# Altium schematic sheet 02. M283.SchDoc
size A3; CheckedBy: 黄钦宁; Author: 陈坤; DocumentNumber: 2; SheetNumber: 2; SheetTotal: 13; PageSetup: Record=PageOptions|CenterHorizontal=True|CenterVertical=True|PrintScale=1.00|XCorrection=1.00|YCorrection=1.00|PrintKind=0|BorderSize=5000000|LeftOffset=0|BottomOffset=0|Orientation=2|PaperLength=1000|PaperWidth=1000|Scale=100|PaperSource=7|PrintQuality=600|MediaType=1|DitherType=10|PaperKind=A4|PrintScaleMode=1; DesignDate: 2013-08-16; CheckDate: 2013-12-28; SheetName: M283; SheetVersion: V1.01; SheetDescription: EasyARM-iMX283工控核心板; ModifiedDate1: 2013-11-30; ModifiedContent1: 修改引脚顺序; ProductName: EasyARM-iMX28学习套件; ProductModel: EasyARM-iMX283
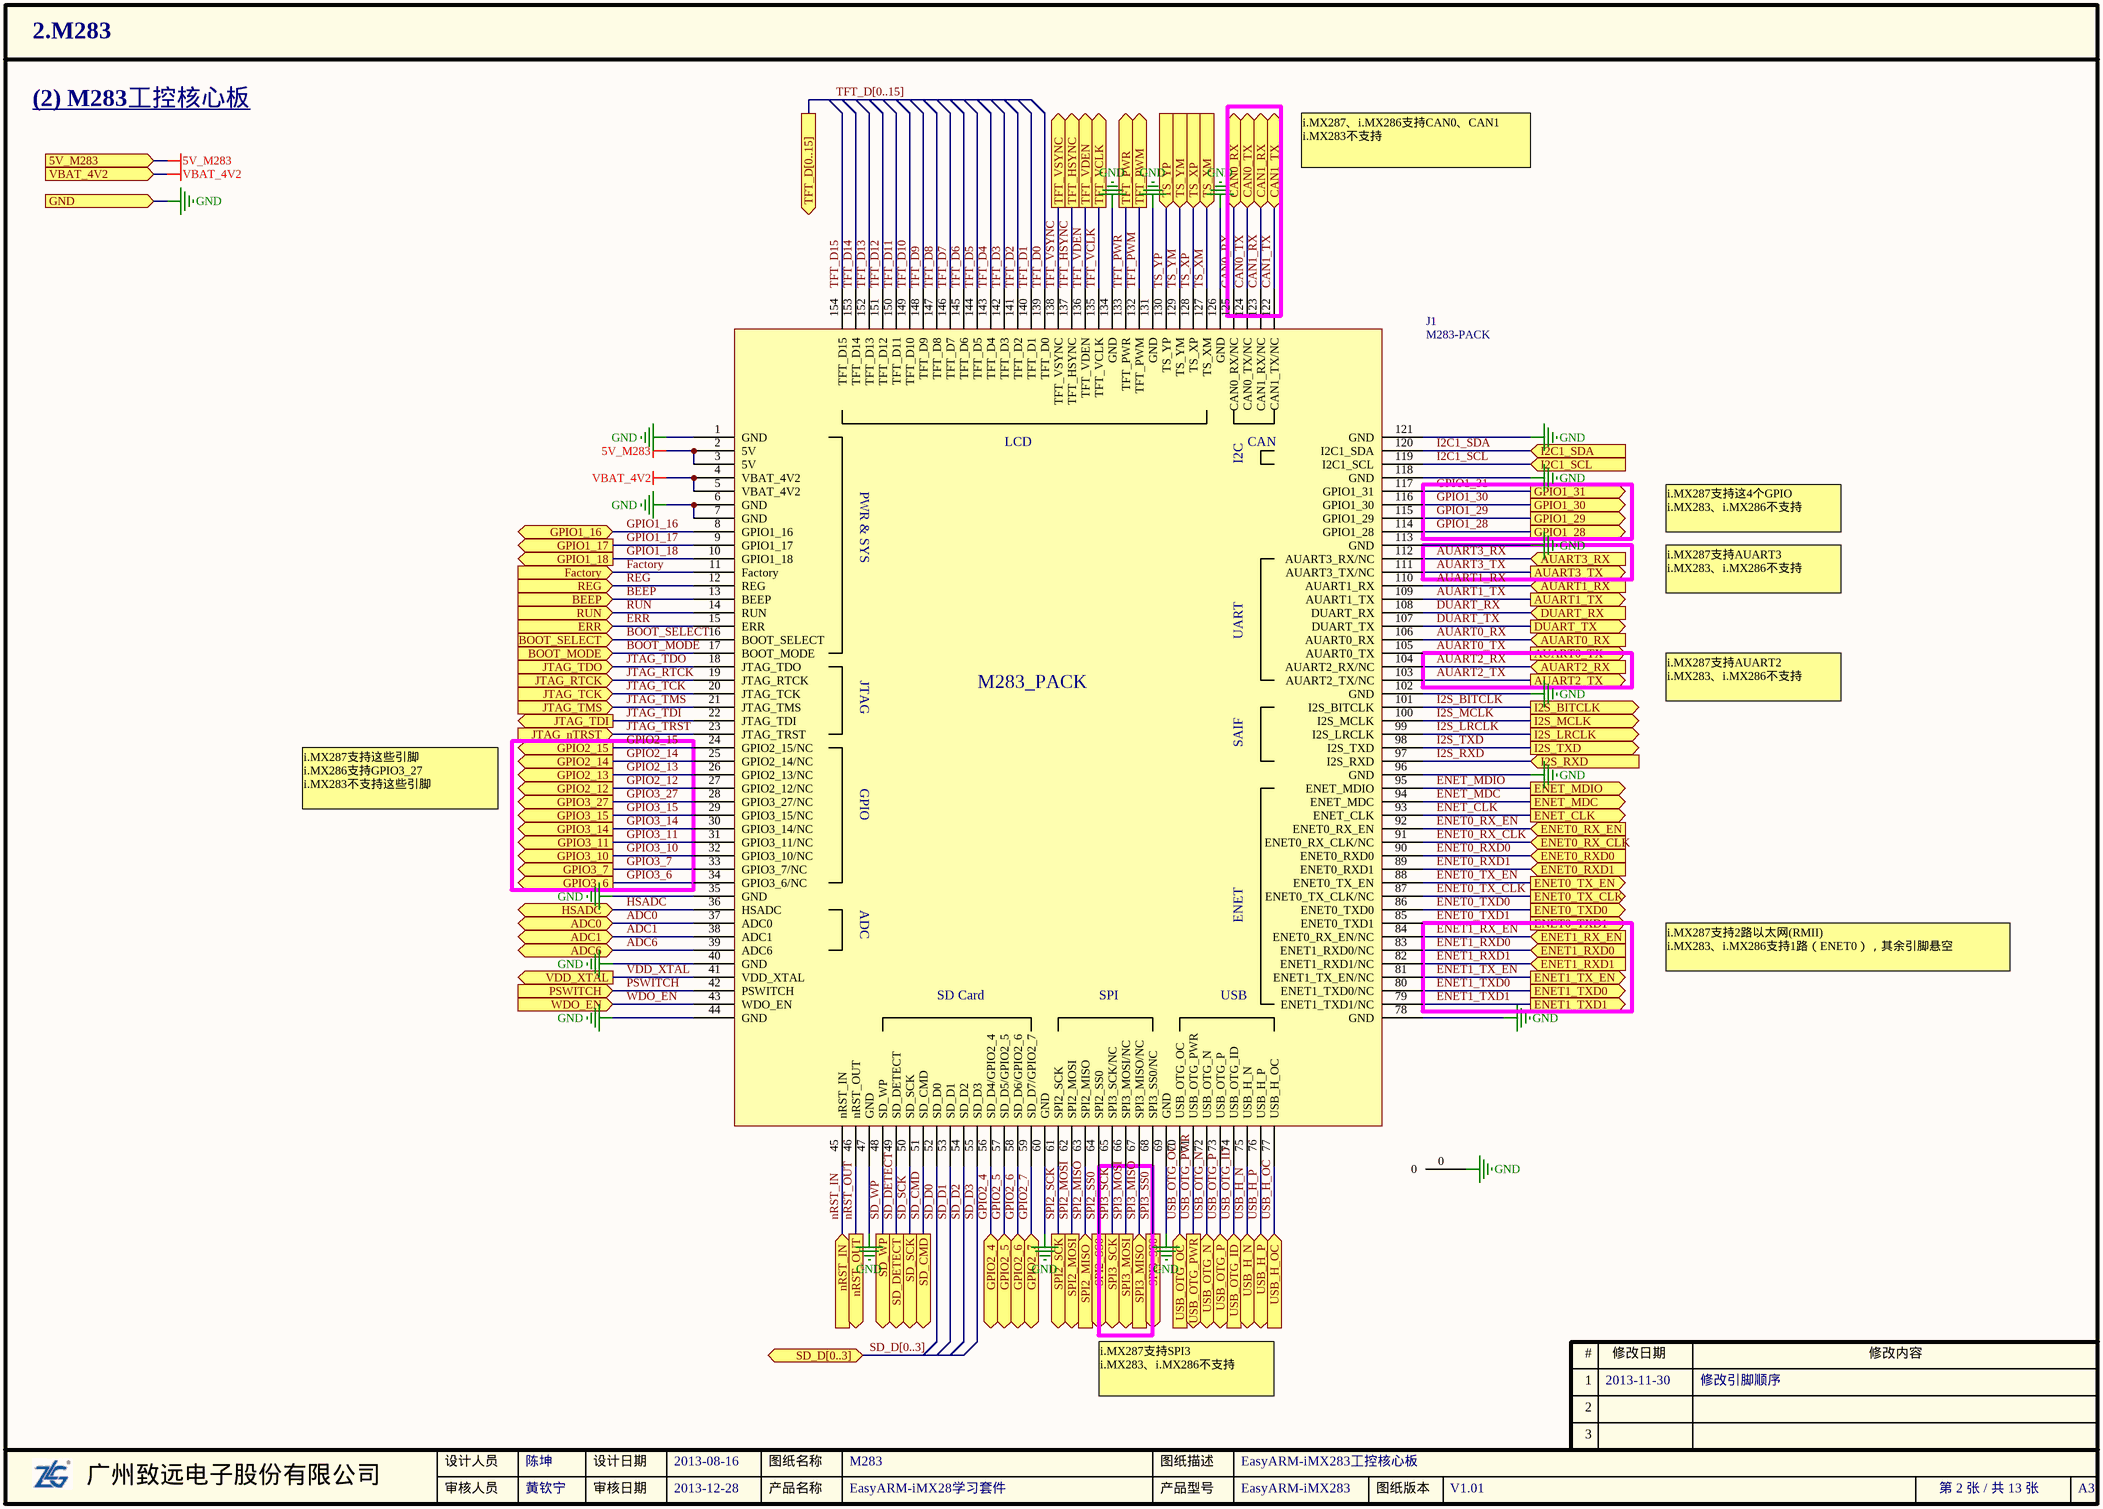
[diagram p0: 02. M283.SchDoc]

## Parts
J1  M283-PACK  [M283-154]

## Ports
5V_M283, ADC0 (bidir), ADC1 (bidir), ADC6 (bidir), AUART0_RX (in), AUART0_TX (out), AUART1_RX (in), AUART1_TX (out), AUART2_RX (in), AUART2_TX (out), AUART3_RX (in), AUART3_TX (out), BEEP (in), BOOT_MODE (in), BOOT_SELECT (in), CAN0_RX (bidir), CAN0_TX (bidir), CAN1_RX (bidir), CAN1_TX (bidir), DUART_RX (in), DUART_TX (out), ENET0_RX_CLK (in), ENET0_RX_EN (in), ENET0_RXD0 (in), ENET0_RXD1 (in), ENET0_TX_CLK (out), ENET0_TX_EN (out), ENET0_TXD0 (out), ENET0_TXD1 (out), ENET1_RX_EN (in), ENET1_RXD0 (in), ENET1_RXD1 (in), ENET1_TX_EN (out), ENET1_TXD0 (out), ENET1_TXD1 (out), ENET_CLK (out), ENET_MDC (out), ENET_MDIO (out), ERR (in), Factory (in), GND, GPIO1_16 (bidir), GPIO1_17 (out), GPIO1_18 (out), GPIO1_28 (out), GPIO1_29 (out), GPIO1_30 (out), GPIO1_31 (out), GPIO2_4 (bidir), GPIO2_5 (bidir), GPIO2_6 (bidir), GPIO2_7 (bidir), GPIO2_12 (out), GPIO2_13 (out), GPIO2_14 (out), GPIO2_15 (out), GPIO3_6 (out), GPIO3_7 (out), GPIO3_10 (out), GPIO3_11 (out), GPIO3_14 (out), GPIO3_15 (out), GPIO3_27 (out), HSADC (bidir), I2C1_SCL (in), I2C1_SDA (in), I2S_BITCLK (out), I2S_LRCLK (out), I2S_MCLK (out), I2S_RXD (in), I2S_TXD (out), JTAG_nTRST (in), JTAG_RTCK (in), JTAG_TCK (in), JTAG_TDI (out), JTAG_TDO (in), JTAG_TMS (in), nRST_IN (in), nRST_OUT (out), PSWITCH (in), REG (in), RUN (in), SD_CMD (out), SD_D[0..3] (bidir), SD_DETECT (out), SD_SCK (out), SD_WP (out), SPI2_MISO (in), SPI2_MOSI (out), SPI2_SCK (out), SPI2_SS0 (out), SPI3_MISO (in), SPI3_MOSI (out), SPI3_SCK (out), SPI3_SS0 (out), TFT_D[0..15] (out), TFT_HSYNC (out), TFT_PWM (out), TFT_PWR (out), TFT_VCLK (out), TFT_VDEN (out), TFT_VSYNC (out), TS_XM (in), TS_XP (in), TS_YM (in), TS_YP (in), USB_H_N (bidir), USB_H_OC (in), USB_H_P (bidir), USB_OTG_ID (in), USB_OTG_N (bidir), USB_OTG_OC (in), USB_OTG_P (bidir), USB_OTG_PWR (out), VBAT_4V2, VDD_XTAL (out), WDO_EN (in)

## Nets
5V_M283: J1.2(5V) J1.3(5V) ; port 5V_M283
GND: J1.0 J1.1(GND) J1.6(GND) J1.7(GND) J1.35(GND) J1.40(GND) J1.44(GND) J1.47(GND) J1.60(GND) J1.69(GND) J1.78(GND) J1.96(GND) J1.102(GND) J1.113(GND) J1.118(GND) J1.121(GND) J1.126(GND) J1.131(GND) J1.134(GND) ; port GND
VBAT_4V2: J1.4(VBAT_4V2) J1.5(VBAT_4V2) ; port VBAT_4V2
ADC0: J1.37(ADC0) ; port ADC0
ADC1: J1.38(ADC1) ; port ADC1
ADC6: J1.39(ADC6) ; port ADC6
AUART0_RX: J1.106(AUART0_RX) ; port AUART0_RX
AUART0_TX: J1.105(AUART0_TX) ; port AUART0_TX
AUART1_RX: J1.110(AUART1_RX) ; port AUART1_RX
AUART1_TX: J1.109(AUART1_TX) ; port AUART1_TX
AUART2_RX: J1.104(AUART2_RX/NC) ; port AUART2_RX
AUART2_TX: J1.103(AUART2_TX/NC) ; port AUART2_TX
AUART3_RX: J1.112(AUART3_RX/NC) ; port AUART3_RX
AUART3_TX: J1.111(AUART3_TX/NC) ; port AUART3_TX
BEEP: J1.13(BEEP) ; port BEEP
BOOT_MODE: J1.17(BOOT_MODE) ; port BOOT_MODE
BOOT_SELECT: J1.16(BOOT_SELECT) ; port BOOT_SELECT
CAN0_RX: J1.125(CAN0_RX/NC) ; port CAN0_RX
CAN0_TX: J1.124(CAN0_TX/NC) ; port CAN0_TX
CAN1_RX: J1.123(CAN1_RX/NC) ; port CAN1_RX
CAN1_TX: J1.122(CAN1_TX/NC) ; port CAN1_TX
DUART_RX: J1.108(DUART_RX) ; port DUART_RX
DUART_TX: J1.107(DUART_TX) ; port DUART_TX
ENET0_RX_CLK: J1.91(ENET0_RX_CLK/NC) ; port ENET0_RX_CLK
ENET0_RX_EN: J1.92(ENET0_RX_EN) ; port ENET0_RX_EN
ENET0_RXD0: J1.90(ENET0_RXD0) ; port ENET0_RXD0
ENET0_RXD1: J1.89(ENET0_RXD1) ; port ENET0_RXD1
ENET0_TX_CLK: J1.87(ENET0_TX_CLK/NC) ; port ENET0_TX_CLK
ENET0_TX_EN: J1.88(ENET0_TX_EN) ; port ENET0_TX_EN
ENET0_TXD0: J1.86(ENET0_TXD0) ; port ENET0_TXD0
ENET0_TXD1: J1.85(ENET0_TXD1) ; port ENET0_TXD1
ENET1_RX_EN: J1.84(ENET0_RX_EN/NC) ; port ENET1_RX_EN
ENET1_RXD0: J1.83(ENET1_RXD0/NC) ; port ENET1_RXD0
ENET1_RXD1: J1.82(ENET1_RXD1/NC) ; port ENET1_RXD1
ENET1_TX_EN: J1.81(ENET1_TX_EN/NC) ; port ENET1_TX_EN
ENET1_TXD0: J1.80(ENET1_TXD0/NC) ; port ENET1_TXD0
ENET1_TXD1: J1.79(ENET1_TXD1/NC) ; port ENET1_TXD1
ENET_CLK: J1.93(ENET_CLK) ; port ENET_CLK
ENET_MDC: J1.94(ENET_MDC) ; port ENET_MDC
ENET_MDIO: J1.95(ENET_MDIO) ; port ENET_MDIO
ERR: J1.15(ERR) ; port ERR
Factory: J1.11(Factory) ; port Factory
GPIO1_16: J1.8(GPIO1_16) ; port GPIO1_16
GPIO1_17: J1.9(GPIO1_17) ; port GPIO1_17
GPIO1_18: J1.10(GPIO1_18) ; port GPIO1_18
GPIO1_28: J1.114(GPIO1_28) ; port GPIO1_28
GPIO1_29: J1.115(GPIO1_29) ; port GPIO1_29
GPIO1_30: J1.116(GPIO1_30) ; port GPIO1_30
GPIO1_31: J1.117(GPIO1_31) ; port GPIO1_31
GPIO2_4: J1.56(SD_D4/GPIO2_4) ; port GPIO2_4
GPIO2_5: J1.57(SD_D5/GPIO2_5) ; port GPIO2_5
GPIO2_6: J1.58(SD_D6/GPIO2_6) ; port GPIO2_6
GPIO2_7: J1.59(SD_D7/GPIO2_7) ; port GPIO2_7
GPIO2_12: J1.27(GPIO2_12/NC) ; port GPIO2_12
GPIO2_13: J1.26(GPIO2_13/NC) ; port GPIO2_13
GPIO2_14: J1.25(GPIO2_14/NC) ; port GPIO2_14
GPIO2_15: J1.24(GPIO2_15/NC) ; port GPIO2_15
GPIO3_6: J1.34(GPIO3_6/NC) ; port GPIO3_6
GPIO3_7: J1.33(GPIO3_7/NC) ; port GPIO3_7
GPIO3_10: J1.32(GPIO3_10/NC) ; port GPIO3_10
GPIO3_11: J1.31(GPIO3_11/NC) ; port GPIO3_11
GPIO3_14: J1.30(GPIO3_14/NC) ; port GPIO3_14
GPIO3_15: J1.29(GPIO3_15/NC) ; port GPIO3_15
GPIO3_27: J1.28(GPIO3_27/NC) ; port GPIO3_27
HSADC: J1.36(HSADC) ; port HSADC
I2C1_SCL: J1.119(I2C1_SCL) ; port I2C1_SCL
I2C1_SDA: J1.120(I2C1_SDA) ; port I2C1_SDA
I2S_BITCLK: J1.101(I2S_BITCLK) ; port I2S_BITCLK
I2S_LRCLK: J1.99(I2S_LRCLK) ; port I2S_LRCLK
I2S_MCLK: J1.100(I2S_MCLK) ; port I2S_MCLK
I2S_RXD: J1.97(I2S_RXD) ; port I2S_RXD
I2S_TXD: J1.98(I2S_TXD) ; port I2S_TXD
JTAG_RTCK: J1.19(JTAG_RTCK) ; port JTAG_RTCK
JTAG_TCK: J1.20(JTAG_TCK) ; port JTAG_TCK
JTAG_TDI: J1.22(JTAG_TDI) ; port JTAG_TDI
JTAG_TDO: J1.18(JTAG_TDO) ; port JTAG_TDO
JTAG_TMS: J1.21(JTAG_TMS) ; port JTAG_TMS
JTAG_TRST: J1.23(JTAG_TRST) ; port JTAG_nTRST
nRST_IN: J1.45(nRST_IN) ; port nRST_IN
nRST_OUT: J1.46(nRST_OUT) ; port nRST_OUT
PSWITCH: J1.42(PSWITCH) ; port PSWITCH
REG: J1.12(REG) ; port REG
RUN: J1.14(RUN) ; port RUN
SD_CMD: J1.51(SD_CMD) ; port SD_CMD
SD_D0: J1.52(SD_D0)
SD_D1: J1.53(SD_D1)
SD_D2: J1.54(SD_D2)
SD_D3: J1.55(SD_D3)
SD_DETECT: J1.49(SD_DETECT) ; port SD_DETECT
SD_SCK: J1.50(SD_SCK) ; port SD_SCK
SD_WP: J1.48(SD_WP) ; port SD_WP
SPI2_MISO: J1.63(SPI2_MISO) ; port SPI2_MISO
SPI2_MOSI: J1.62(SPI2_MOSI) ; port SPI2_MOSI
SPI2_SCK: J1.61(SPI2_SCK) ; port SPI2_SCK
SPI2_SS0: J1.64(SPI2_SS0) ; port SPI2_SS0
SPI3_MISO: J1.67(SPI3_MISO/NC) ; port SPI3_MISO
SPI3_MOSI: J1.66(SPI3_MOSI/NC) ; port SPI3_MOSI
SPI3_SCK: J1.65(SPI3_SCK/NC) ; port SPI3_SCK
SPI3_SS0: J1.68(SPI3_SS0/NC) ; port SPI3_SS0
TFT_D0: J1.139(TFT_D0)
TFT_D1: J1.140(TFT_D1)
TFT_D2: J1.141(TFT_D2)
TFT_D3: J1.142(TFT_D3)
TFT_D4: J1.143(TFT_D4)
TFT_D5: J1.144(TFT_D5)
TFT_D6: J1.145(TFT_D6)
TFT_D7: J1.146(TFT_D7)
TFT_D8: J1.147(TFT_D8)
TFT_D9: J1.148(TFT_D9)
TFT_D10: J1.149(TFT_D10)
TFT_D11: J1.150(TFT_D11)
TFT_D12: J1.151(TFT_D12)
TFT_D13: J1.152(TFT_D13)
TFT_D14: J1.153(TFT_D14)
TFT_D15: J1.154(TFT_D15)
TFT_HSYNC: J1.137(TFT_HSYNC) ; port TFT_HSYNC
TFT_PWM: J1.132(TFT_PWM) ; port TFT_PWM
TFT_PWR: J1.133(TFT_PWR) ; port TFT_PWR
TFT_VCLK: J1.135(TFT_VCLK) ; port TFT_VCLK
TFT_VDEN: J1.136(TFT_VDEN) ; port TFT_VDEN
TFT_VSYNC: J1.138(TFT_VSYNC) ; port TFT_VSYNC
TS_XM: J1.127(TS_XM) ; port TS_XM
TS_XP: J1.128(TS_XP) ; port TS_XP
TS_YM: J1.129(TS_YM) ; port TS_YM
TS_YP: J1.130(TS_YP) ; port TS_YP
USB_H_N: J1.75(USB_H_N) ; port USB_H_N
USB_H_OC: J1.77(USB_H_OC) ; port USB_H_OC
USB_H_P: J1.76(USB_H_P) ; port USB_H_P
USB_OTG_ID: J1.74(USB_OTG_ID) ; port USB_OTG_ID
USB_OTG_N: J1.72(USB_OTG_N) ; port USB_OTG_N
USB_OTG_OC: J1.70(USB_OTG_OC) ; port USB_OTG_OC
USB_OTG_P: J1.73(USB_OTG_P) ; port USB_OTG_P
USB_OTG_PWR: J1.71(USB_OTG_PWR) ; port USB_OTG_PWR
VDD_XTAL: J1.41(VDD_XTAL) ; port VDD_XTAL
WDO_EN: J1.43(WDO_EN) ; port WDO_EN

## Buses and harness runs
bus SD_D[0..3] = port SD_D[0..3]
bus TFT_D[0..15] = port TFT_D[0..15]

## Notes on the sheet
- (2) M283工控核心板
- i.MX287、i.MX286支持CAN0、CAN1
  i.MX283不支持
- i.MX287支持这4个GPIO
  i.MX283、i.MX286不支持
- i.MX287支持AUART3
  i.MX283、i.MX286不支持
- i.MX287支持AUART2
  i.MX283、i.MX286不支持
- i.MX287支持这些引脚
  i.MX286支持GPIO3_27
  i.MX283不支持这些引脚
- i.MX287支持2路以太网(RMII)
  i.MX283、i.MX286支持1路（ENET0），其余引脚悬空
- i.MX287支持SPI3
  i.MX283、i.MX286不支持
- 1
- #
- 修改日期
- 修改内容
- 2
- 3
- 广州致远电子股份有限公司
- 设计人员
- 审核人员
- 设计日期
- 审核日期
- 产品名称
- 图纸名称
- 产品型号
- 图纸描述
- 图纸版本
- A3
- (in symbol M283-PACK) LCD; CAN; I2C; PWR & SYS; UART; JTAG; M283_PACK; SAIF; GPIO; ADC; ENET; SD Card; SPI; USB

## Library data of the parts
J1 = M283-PACK: M283